# Altium schematic sheet USB.SchDoc
size A
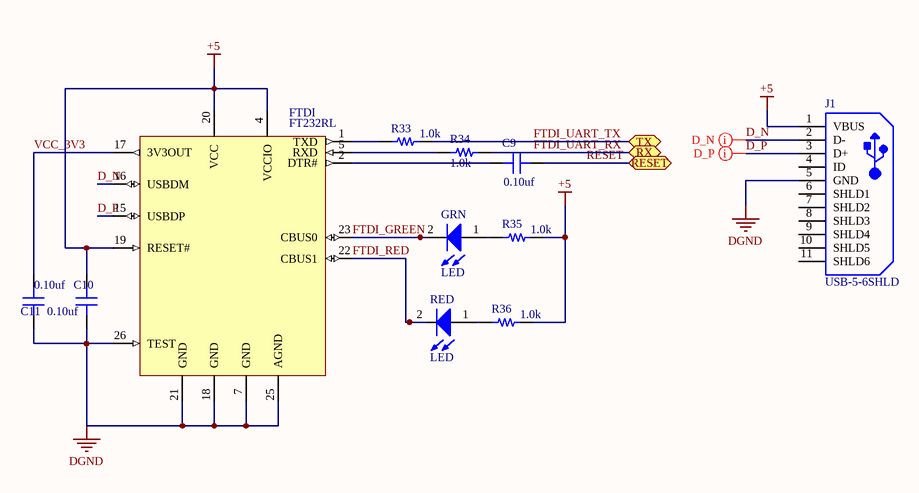
[diagram p0: USB.SchDoc]

## Parts
C9  value 0.10uf  [CAP 0603/1608]  (hidden comment: Capacitor MLCC 0.10uf 25V CAP 0603/1608)
C10  value 0.10uf  [CAP 0603/1608]  (hidden comment: Capacitor MLCC 0.10uf 25V CAP 0603/1608)
C11  value 0.10uf  [CAP 0603/1608]  (hidden comment: Capacitor MLCC 0.10uf 25V CAP 0603/1608)
FTDI  FT232RL  [SSOP-28]
GRN  LED  [0805_LED]
J1  USB-5-6SHLD  [TECO-1981568-5_V]
R33  value 1.0k  [RES 0805/2012]  (hidden comment: Resistor 1.0k 0805 1/4W 1%)
R34  value 1.0k  [RES 0805/2012]  (hidden comment: Resistor 1.0k 0805 1/4W 1%)
R35  value 1.0k  [RES 0805/2012]  (hidden comment: Resistor 1.0k 0805 1/4W 1%)
R36  value 1.0k  [RES 0805/2012]  (hidden comment: Resistor 1.0k 0805 1/4W 1%)
RED  LED  [0805_LED]

## Ports
RESET (bidir), RX (bidir), TX (bidir)

## Nets
+5: C10.2 FTDI.4(VCCIO) FTDI.19(RESET#) FTDI.20(VCC) J1.1(VBUS) R35.2 R36.2
DGND: C10.1 C11.1 FTDI.7(GND) FTDI.18(GND) FTDI.21(GND) FTDI.25(AGND) FTDI.26(TEST) J1.5(GND)
D_N: FTDI.16(USBDM) J1.2(D-)
D_P: FTDI.15(USBDP) J1.3(D+)
FTDI_GREEN: FTDI.23(CBUS0) GRN.2(K)
FTDI_RED: FTDI.22(CBUS1) RED.2(K)
FTDI_UART_RX: R34.2 ; port RX
FTDI_UART_TX: R33.2 ; port TX
RESET: C9.2 ; port RESET
VCC_3V3: C11.2 FTDI.17(3V3OUT)
NetC9_1: C9.1 FTDI.2(DTR#)
NetFTDI_1: FTDI.1(TXD) R33.1
NetFTDI_5: FTDI.5(RXD) R34.1
NetGRN_1: GRN.1(A) R35.1
NetR36_1: R36.1 RED.1(A)

Not connected (* = marked no-connect by the designer): J1 4(ID) 6(SHLD1) 7(SHLD2) 8(SHLD3) 9(SHLD4) 10(SHLD5) 11(SHLD6)

## Layout directives
differential pair: D_N, D_P

## Library data of the parts
C9-C11 = 583: Manufacturer_id: 1; idCapacitor: 583; Name: Cap_0.10uf_25V_CAP 0603/1608; Dielectric: Ceramic; Created_By: Nick Mah; Drawer_id: 1; Voltage_Rating: 25V; Package: CAP 0603/1608; Created_Date: 10/20/2018
FTDI = 3: Manufacturer_id: 1; idIC_Interface: 3; Name: USB FTDI; Protocol: UART; Vin(Min): 3.3; Vin(Max): 5.25; Created_By: Kyle; Drawer_id: 1; MfrPartNo: FT232RL; Link: https://www.digikey.com/product-detail/en/ftdi-future-technology-devices-international-ltd/FT232RL-REEL/768-1007-1-ND/1836402
GRN = 2: Manufacturer_id: 1; idLED: 2; Name: LED_0805_GREEN; Value: Green; Brightness: 35mcd; Id: 20mA; Vf: 2V; Drawer_id: 1
J1 = 5: USB Micro Type B; Manufacturer_id: 1; MfrPartNo: 1981568-1; idConn: 5; Name: TE USB Micro; Value: CONN; Created_By: Aiku; Drawer_id: 1; Num_Contacts: 5; Link: https://www.mouser.com/ProductDetail/TE-Connectivity-AMP/1981568-1?qs=sGAEpiMZZMulM8LPOQ%252bykzEIUPbUCiSfqsfxH3Oq%252bYo%3d; ComponentLink1Description: Datasheet; Supplier1: TE; Created_Date: 10/20/2018
R33-R36 = 721: Manufacturer_id: 1; idResistor: 721; Name: Res_1.0k_0805_1/4W_1%; Created_By: Nick Mah; Supplier 1: Digi-Key; Drawer_id: 1; Tolerance: 1%; Power: 1/4W; Package: 0805; ComponentLink1Description: Datasheet; Created_Date: 2018-10-20
RED = 1: idLED: 1; Name: LED_0805_RED; Value: Red; Vf: 0.7V; Manufacturer_id: 1; Drawer_id: 1